# Altium project DEV_BOARD_FULL.PrjPcb (part 1 of 2)
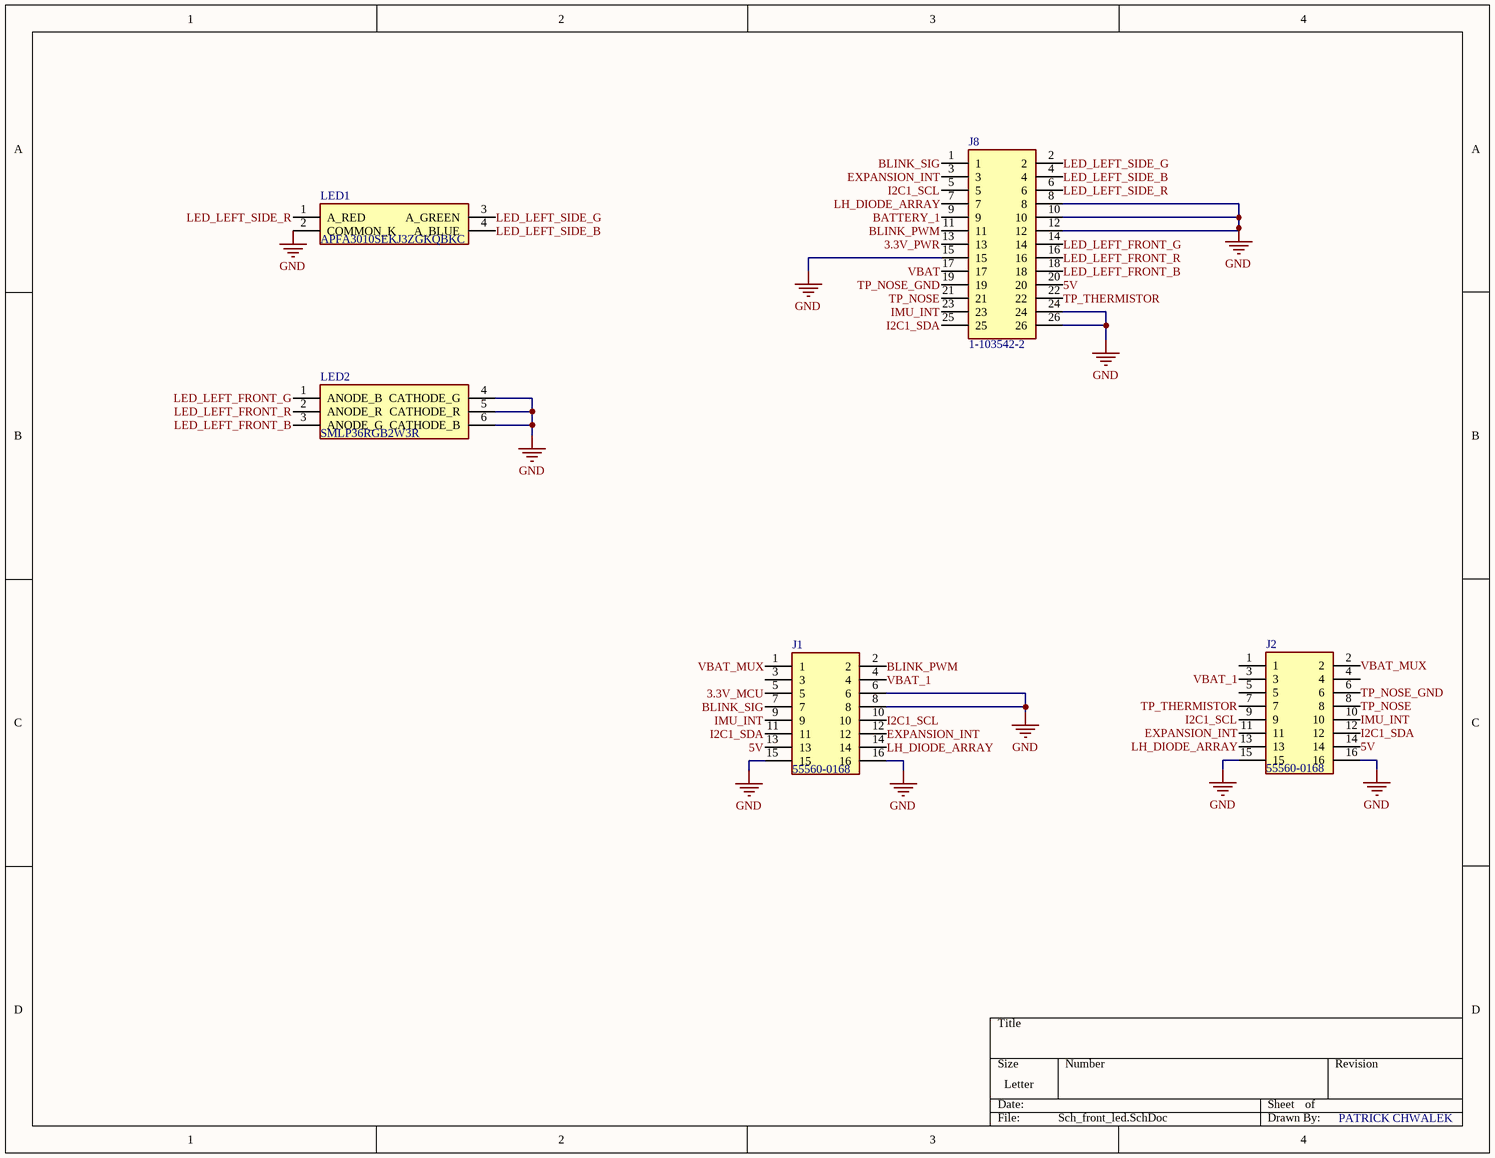
[diagram p0: Sch_front_led.SchDoc]
10 sheets, 179 parts. Net scope: global (net labels, ports and power ports of the same name join across sheets).
Board file: dev_board_layout.PcbDoc
Sheets:
  Sch_front_led.SchDoc
  Sch_front.SchDoc
  sch_pwr_brd_sensors.SchDoc
  Sch_pwr_brd_pwr_sys.SchDoc
  Sch_pwr_brd_pwr.SchDoc
  Sch_pwr_brd_MCU.SchDoc
  Sch_mcu_brd_sensors.SchDoc
  Sch_mcu_brd_pwr.SchDoc
  Sch_mcu_brd_external_connectors.SchDoc
  Sch_mcu_brd_mcu.SchDoc

## Sheet Sch_front_led.SchDoc
size Letter

### Parts
J1  55560-0168  [555600168]
J2  55560-0168  [555600168]
J8  1-103542-2  [HDRV26W89P254X254_2X13_3261X506X1074P]
LED1  APFA3010SEKJ3ZGKQBKC  [KPFA-3010RGBC-11]
LED2  SMLP36RGB2W3R  [ROHM-1510-(0604)]

### Nets
3.3V_MCU: J1.5
3.3V_PWR: J8.13
GND: J1.6 J1.8 J1.15 J1.16 J2.15 J2.16 J8.8 J8.10 J8.12 J8.15 J8.24 J8.26 LED1.2(COMMON_K) LED2.4(CATHODE_G) LED2.5(CATHODE_R) LED2.6(CATHODE_B)
5V: J1.13 J2.14 J8.20
BATTERY_1: J8.9
BLINK_PWM: J1.2 J8.11
BLINK_SIG: J1.7 J8.1
EXPANSION_INT: J1.12 J2.11 J8.3
I2C1_SCL: J1.10 J2.9 J8.5
I2C1_SDA: J1.11 J2.12 J8.25
IMU_INT: J1.9 J2.10 J8.23
LED_LEFT_FRONT_B: J8.18 LED2.3(ANODE_G)
LED_LEFT_FRONT_G: J8.14 LED2.1(ANODE_B)
LED_LEFT_FRONT_R: J8.16 LED2.2(ANODE_R)
LED_LEFT_SIDE_B: J8.4 LED1.4(A_BLUE)
LED_LEFT_SIDE_G: J8.2 LED1.3(A_GREEN)
LED_LEFT_SIDE_R: J8.6 LED1.1(A_RED)
LH_DIODE_ARRAY: J1.14 J2.13 J8.7
TP_NOSE: J2.8 J8.21
TP_NOSE_GND: J2.6 J8.19  [project net CMOUT]
TP_THERMISTOR: J2.7 J8.22
VBAT: J8.17
VBAT_1: J1.4 J2.3
VBAT_MUX: J1.1 J2.2

Not connected (* = marked no-connect by the designer): J1 3; J2 1 4 5

### Notes on the sheet
- PATRICK CHWALEK

### Library data of the parts
J1 J2 = 55560-0168: Connector; Manufacturer_Name: Molex; Allied_Number: 70374726; Datasheet Link: https://www.molex.com/pdm_docs/sd/555600168_sd.pdf; Height: 1.15mm; Manufacturer_Part_Number: 55560-0168; Mouser Part Number: 538-55560-0168; Mouser Price/Stock: https://www.mouser.com/Search/Refine.aspx?Keyword=538-55560-0168; RS Part Number: 7206558P; RS Price/Stock: http://uk.rs-online.com/web/p/products/7206558P; Allied Price/Stock: https://www.alliedelec.com/molexincorporated-55560-0168/70374726/
J8 = 1-103542-2: Connector; Manufacturer_Name: TE Connectivity; Datasheet Link: http://www.te.com/commerce/DocumentDelivery/DDEController?Action=showdoc&DocId=Customer+Drawing%7F103542%7FJ3%7Fpdf%7FEnglish%7FENG_CD_103542_J3.pdf%7F1-103542-2; Height: 10.744mm; Manufacturer_Part_Number: 1-103542-2; Mouser Part Number: 571-1-103542-2; Mouser Price/Stock: https://www.mouser.com/Search/Refine.aspx?Keyword=571-1-103542-2
LED1 = APFA3010SEKJ3ZGKQBKC: LED; Manufacturer_Name: Kingbright; Allied_Number: 70820377; Datasheet Link: http://www.kingbrightusa.com/images/catalog/SPEC/APFA3010SEKJ3ZGKQBKC.pdf; Manufacturer_Part_Number: APFA3010SEKJ3ZGKQBKC; Mouser Part Number: 604-APFA3010SEKJ3ZGK; Mouser Price/Stock: https://www.mouser.com/Search/Refine.aspx?Keyword=604-APFA3010SEKJ3ZGK; Allied Price/Stock: https://www.alliedelec.com/kingbright-apfa3010sekj3zgkqbkc/70820377/
LED2 = SMLP36RGB2W3R: LED; Manufacturer_Name: ROHM Semiconductor; Datasheet Link: http://www.rohm.com/web/global/datasheet/SMLP36RGB2W(R); Manufacturer_Part_Number: SMLP36RGB2W3R; Mouser Part Number: 755-SMLP36RGB2W3R; Mouser Price/Stock: https://www.mouser.com/Search/Refine.aspx?Keyword=755-SMLP36RGB2W3R; RS Part Number: 1246884; RS Price/Stock: https://uk.rs-online.com/web/p/products/1246884

## Sheet Sch_front.SchDoc
size A
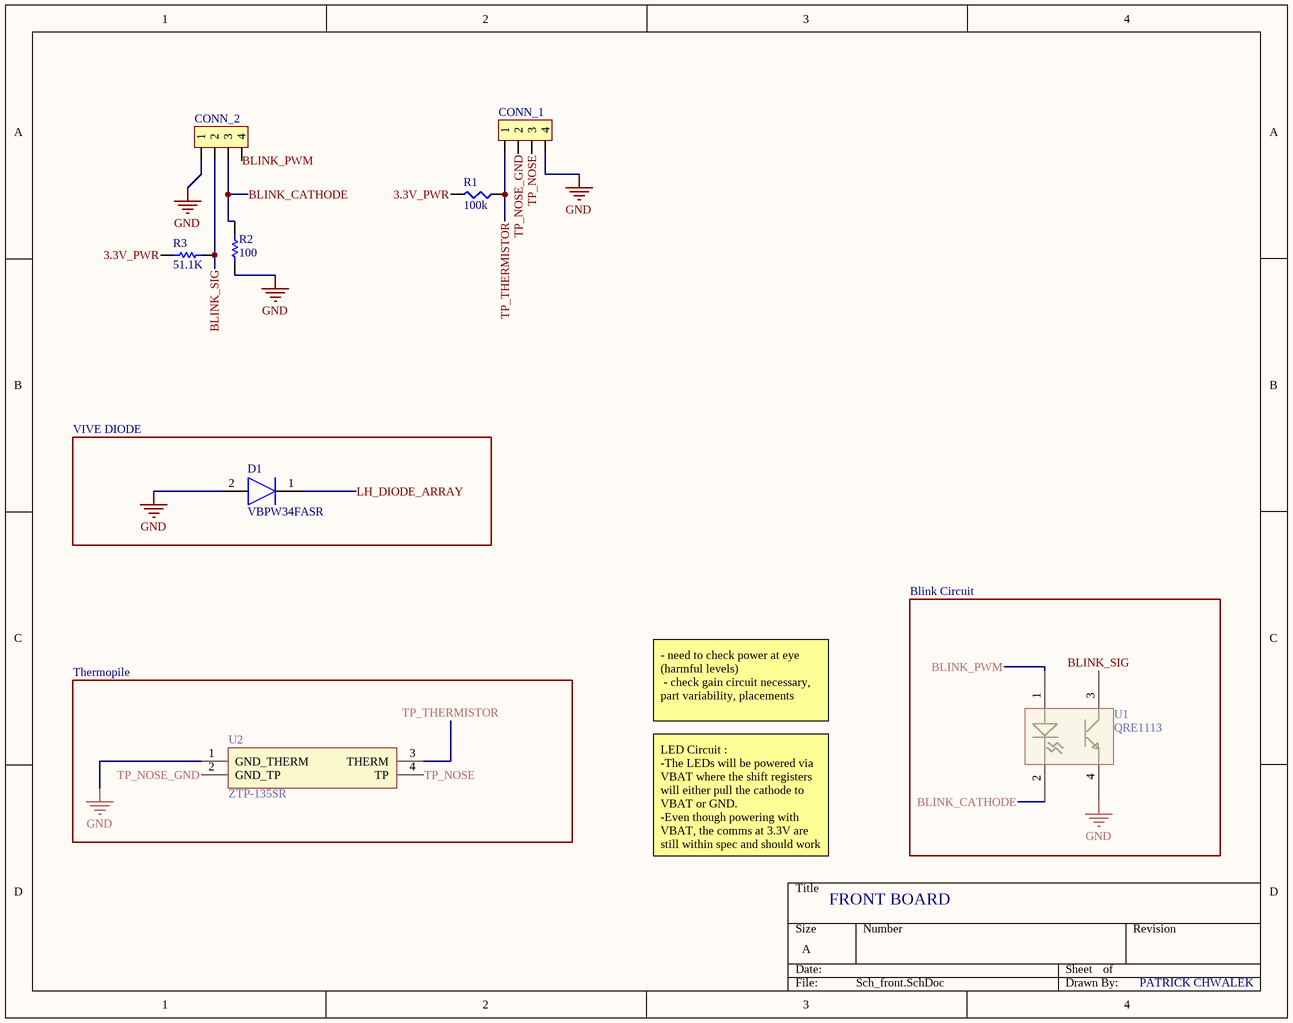
[diagram p1: Sch_front.SchDoc]

### Parts
CONN_1  THERMO  [4_pos_1mm_header]  (value not drawn)
CONN_2  BLINK  [4_pos_1mm_header]  (value not drawn)
D1  VBPW34FASR  [VBPW34FAS]
R1  100k  [SMD-0402-RES]
R2  100  [SMD-0402C]
R3  51.1K  [SMD-0402-RES]
U1  QRE1113  [QRE1113_DIP]
U2  ZTP-135SR  [ZTP-135SR]

### Blocks framed on the sheet
VIVE DIODE: D1
Blink Circuit: U1
Thermopile: U2

### Nets
3.3V_PWR: R1.2 R3.2
GND: CONN_1.4 CONN_2.1 D1.2(K) R2.1 U1.4 U2.1(GND_THERM)
BLINK_CATHODE: CONN_2.3 R2.2 U1.2
BLINK_PWM: CONN_2.4 U1.1
BLINK_SIG: CONN_2.2 R3.1 U1.3
LH_DIODE_ARRAY: D1.1(A)
TP_NOSE: CONN_1.3 U2.4(TP)
TP_NOSE_GND: CONN_1.2 U2.2(GND_TP)  [project net CMOUT]
TP_THERMISTOR: CONN_1.1 R1.1 U2.3(THERM)

### Notes on the sheet
- - need to check power at eye  (harmful levels)
  - check gain circuit necessary, part variability, placements
- LED Circuit :
  -The LEDs will be powered via VBAT where the shift registers will either pull the cathode to VBAT or GND.
  -Even though powering with VBAT, the comms at 3.3V are still within spec and should work
- FRONT BOARD
- PATRICK CHWALEK

### Library data of the parts
CONN_1 CONN_2 = 4_pin_1mm_header
D1 = VBPW34FASR: Diode; Manufacturer_Name: Vishay; Datasheet Link: https://www.vishay.com/docs/81127/vbpw34fa.pdf; Height: 1.3mm; Manufacturer_Part_Number: VBPW34FASR; Mouser Part Number: 782-VBPW34FASR; Mouser Price/Stock: https://www.mouser.com/Search/Refine.aspx?Keyword=782-VBPW34FASR; RS Part Number: 7689401; RS Price/Stock: https://uk.rs-online.com/web/p/products/7689401
R1 = ERJ-2GEJ104X: RES SMD 100K OHM 5% 1/10W 0402; Manufacturer: Panasonic Electronic Components; Factory Stock: 0; Unit Price (USD): 0.00350; @ qty: 1500; Minimum Quantity: 1; Power (Watts): 0.1W, 1/10W; Temperature Coefficient: ±200ppm/°C; Part Number: ERJ-2GEJ104X; Datasheets: http://industrial.panasonic.com/www-cgi/jvcr13pz.cgi?E+PZ+3+AOA0001+ERJ2GEJ104X+7+WW; Image: //media.digikey.com/Photos/Panasonic%20Photos/ERJ-PA2-Series.jpg; Digi-Key Part Number: P100KJCT-ND; Quantity Available: 2387986; Packaging: Cut Tape (CT); Series: ERJ; Part Status: Active; Value: 100k; Tolerance: ±5%; Composition: Thick Film; Features: Automotive AEC-Q200; Operating Temperature: -55°C ~ 155°C; Package / Case: 0402 (1005 Metric); Supplier Device Package: 0402; Size / Dimension: 0.039" L x 0.020" W (1.00mm x 0.50mm); Height - Seated (Max): 0.016" (0.40mm); Number of Terminations: 2; Failure Rate: -
R2 R3 = Resistor
U1 = QRE1113: IR Emitter and Receiver
U2 = ZTP-135SR: Undefined or Miscellaneous; Manufacturer_Name: Amphenol Advanced Sensors; Allied_Number: 70282698; Datasheet Link: https://www.amphenol-sensors.com/en/component/edocman/370-thermopile-ir-sensor-applications/download?Itemid=7967; Manufacturer_Part_Number: ZTP-135SR; Mouser Part Number: 527-ZTP-135SR; Mouser Price/Stock: https://www.mouser.com/Search/Refine.aspx?Keyword=527-ZTP-135SR; Allied Price/Stock: https://www.alliedelec.com/amphenol-advanced-sensors-ztp-135sr/70282698/

## Sheet sch_pwr_brd_sensors.SchDoc
size Letter
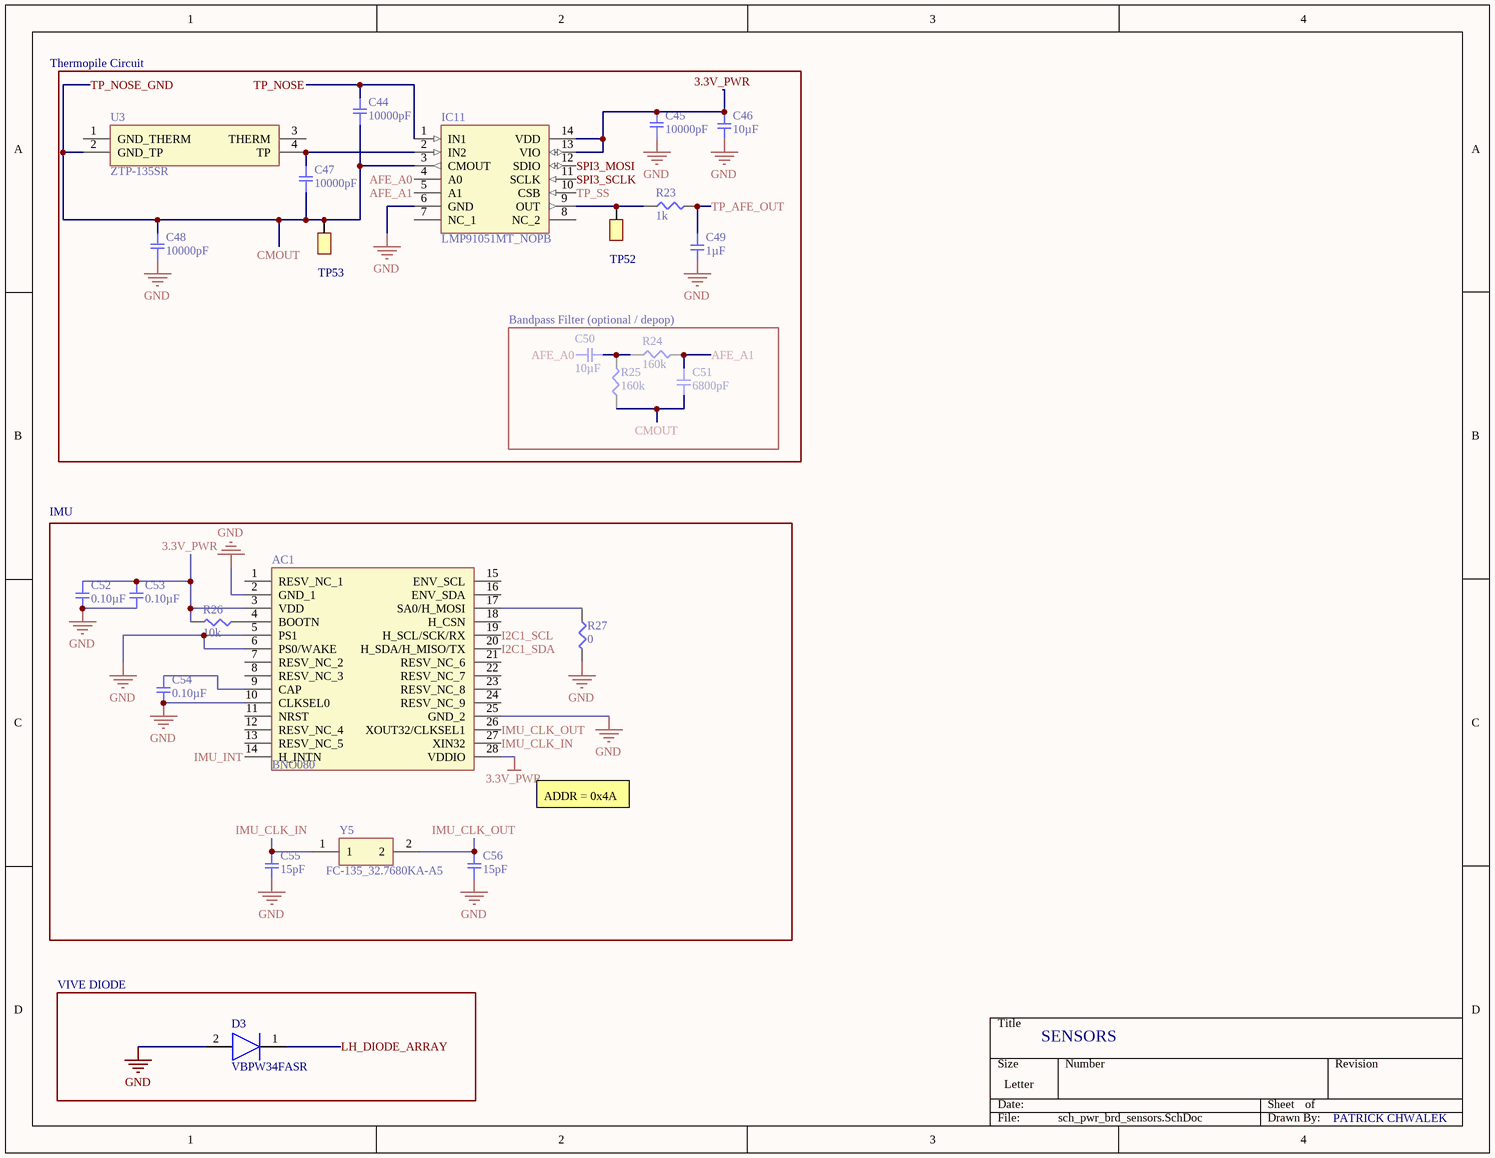
[diagram p2: sch_pwr_brd_sensors.SchDoc]

### Parts
AC1  BNO080  [BNO080]
C44  10000pF  [SMD-0402C]
C45  10000pF  [SMD-0402C]
C46  10µF  [SMD-0402C]
C47  10000pF  [SMD-0402C]
C48  10000pF  [SMD-0402C]
C49  1µF  [SMD-0402C]
C50  10µF  [SMD-0402C]
C51  6800pF  [SMD-0402C]
C52  0.10µF  [CAPC1005X55N]
C53  0.10µF  [CAPC1005X55N]
C54  0.10µF  [CAPC1005X55N]
C55  15pF  [CAPC1005X55N]
C56  15pF  [CAPC1005X55N]
D3  VBPW34FASR  [VBPW34FASR]
IC11  LMP91051MT_NOPB  [SOP65P640X120-14N]
R23  1k  [SMD-0402-RES]
R24  160k  [SMD-0402-RES]
R25  160k  [SMD-0402-RES]
R26  10k  [SMD-0402-RES]
R27  0  [SMD-0402-RES]
TP52  TestPoint  [TestPoint_0.4mm]  (value not drawn)
TP53  TestPoint  [TestPoint_0.4mm]  (value not drawn)
U3  ZTP-135SR  [ZTP-135SR]
Y5  FC-135_32.7680KA-A5  [FC135327680KAAG0]

### Blocks framed on the sheet
Bandpass Filter (optional / depop): C50 C51 R24 R25
IMU: AC1 C52-C56 R26 R27 Y5
VIVE DIODE: D3

### Nets
3.3V_PWR: AC1.3(VDD) AC1.28(VDDIO) C45.2 C46.1 C52.1 C53.1 IC11.13(VIO) IC11.14(VDD) R26.2
GND: AC1.2(GND_1) AC1.5(PS1) AC1.6(PS0/WAKE) AC1.10(CLKSEL0) AC1.25(GND_2) C45.1 C46.2 C48.1 C49.2 C52.2 C53.2 C54.2 C55.2 C56.2 D3.2(K) IC11.6(GND) R27.2
AFE_A0: C50.1 IC11.4(A0)
AFE_A1: C51.1 IC11.5(A1) R24.2
CMOUT: C44.1 C47.1 C48.2 C51.2 IC11.3(CMOUT) R25.1 TP53.1 U3.2(GND_TP)  [also labelled TP_NOSE_GND]
I2C1_SCL: AC1.19(H_SCL/SCK/RX)
I2C1_SDA: AC1.20(H_SDA/H_MISO/TX)
IMU_CLK_IN: AC1.27(XIN32) C55.1 Y5.1
IMU_CLK_OUT: AC1.26(XOUT32/CLKSEL1) C56.1 Y5.2
IMU_INT: AC1.14(H_INTN)
LH_DIODE_ARRAY: D3.1(A)
SPI3_MOSI: IC11.12(SDIO)
SPI3_SCLK: IC11.11(SCLK)
TP_AFE_OUT: C49.1 R23.2
TP_NOSE: C44.2 IC11.1(IN1)
TP_SS: IC11.10(CSB)
NetAC1_4: AC1.4(BOOTN) R26.1
NetAC1_9: AC1.9(CAP) C54.1
NetAC1_17: AC1.17(SA0/H_MOSI) R27.1
NetC47_2: C47.2 IC11.2(IN2) U3.4(TP)
NetC50_2: C50.2 R24.1 R25.2
NetIC11_9: IC11.9(OUT) R23.1 TP52.1

Not connected (* = marked no-connect by the designer): AC1 1(RESV_NC_1) 7(RESV_NC_2) 8(RESV_NC_3) 11(NRST) 12(RESV_NC_4) 13(RESV_NC_5) 15(ENV_SCL) 16(ENV_SDA) 18(H_CSN) 21(RESV_NC_6) 22(RESV_NC_7) 23(RESV_NC_8) 24(RESV_NC_9); IC11 7(NC_1) 8(NC_2); U3 1(GND_THERM) 3(THERM)

### Notes on the sheet
- Thermopile Circuit
- ADDR = 0x4A
- SENSORS
- PATRICK CHWALEK

### Library data of the parts
AC1 = BNO080: Accelerometer; Manufacturer_Name: Hillcrest Laboratories; Datasheet Link: http://www.hillcrestlabs.com/download/5a05f340566d07c196001ec1; Height: 1.18mm; Manufacturer_Part_Number: BNO080
C44 C45 C47 C48 = GCM155R71H103KA55D: CAP CER 10000PF 50V X7R 0402; Manufacturer: Murata Electronics North America; Factory Stock: 0; Unit Price (USD): 0.1; Minimum Quantity: 1; Tolerance: ±10%; Datasheets: http://www.murata.com/~/media/webrenewal/support/library/catalog/products/capacitor/mlcc/c03e.ashx; Image: //media.digikey.com/Renders/Murata%20Renders/ZRB-SERIES-0402.jpg; Digi-Key Part Number: 490-4762-1-ND; Part Number: GCM155R71H103KA55D; Quantity Available: 650067; @ qty: 0; Packaging: Cut Tape (CT); Series: GCM; Part Status: Active; Value: 10000pF; Voltage: 50V; Temperature Coefficient: X7R; Operating Temperature: -55°C ~ 125°C; Features: -; Ratings: AEC-Q200; Applications: Automotive; Mounting Type: Surface Mount, MLCC; Package / Case: 0402 (1005 Metric); Size / Dimension: 0.039" L x 0.020" W (1.00mm x 0.50mm); Height - Seated (Max): -; Thickness (Max): 0.022" (0.55mm); Lead Spacing: -; Lead Style: -
C46 C50 = GRJ155R60J106ME11D: CAP CER 10UF 6.3V X5R 0402; Manufacturer: Murata Electronics North America; Factory Stock: 0; Unit Price (USD): 0.23; Minimum Quantity: 1; Tolerance: ±20%; Datasheets: http://psearch.en.murata.com/capacitor/product/GRJ155R60J106ME11%23.pdf; Image: //media.digikey.com/Renders/Murata%20Renders/ZRB-SERIES-0402.jpg; Digi-Key Part Number: 490-13211-1-ND; Part Number: GRJ155R60J106ME11D; Quantity Available: 64064; @ qty: 0; Packaging: Cut Tape (CT); Series: GRJ; Part Status: Active; Value: 10µF; Voltage: 6.3V; Temperature Coefficient: X5R; Operating Temperature: -55°C ~ 85°C; Features: Derating Recommended, Soft Termination; Ratings: -; Applications: Boardflex Sensitive; Mounting Type: Surface Mount, MLCC; Package / Case: 0402 (1005 Metric); Size / Dimension: 0.039" L x 0.020" W (1.00mm x 0.50mm); Height - Seated (Max): -; Thickness (Max): 0.028" (0.70mm); Lead Spacing: -; Lead Style: -
C49 = GCM155C71A105KE38D: CAP CER 1UF 10V X7S 0402; Manufacturer: Murata Electronics North America; Factory Stock: 0; Unit Price (USD): 0.12; Minimum Quantity: 1; Tolerance: ±10%; Datasheets: http://www.murata.com/~/media/webrenewal/support/library/catalog/products/capacitor/mlcc/c03e.ashx; Image: //media.digikey.com/Renders/Murata%20Renders/ZRB-SERIES-0402.jpg; Digi-Key Part Number: 490-13409-1-ND; Part Number: GCM155C71A105KE38D; Quantity Available: 7240; @ qty: 0; Packaging: Cut Tape (CT); Series: GCM; Part Status: Active; Value: 1µF; Voltage: 10V; Temperature Coefficient: X7S; Operating Temperature: -55°C ~ 125°C; Features: -; Ratings: AEC-Q200; Applications: Automotive; Mounting Type: Surface Mount, MLCC; Package / Case: 0402 (1005 Metric); Size / Dimension: 0.039" L x 0.020" W (1.00mm x 0.50mm); Height - Seated (Max): -; Thickness (Max): 0.022" (0.55mm); Lead Spacing: -; Lead Style: -
C51 = GRM155R71E682KA01J: CAP CER 6800PF 25V X7R 0402; Manufacturer: Murata Electronics North America; Factory Stock: 0; Unit Price (USD): 0.1; Minimum Quantity: 1; Tolerance: ±10%; Datasheets: http://www.murata.com/~/media/webrenewal/support/library/catalog/products/capacitor/mlcc/c02e.pdf; Image: //media.digikey.com/Renders/Murata%20Renders/ZRB-SERIES-0402.jpg; Digi-Key Part Number: 490-11422-1-ND; Part Number: GRM155R71E682KA01J; Quantity Available: 44380; @ qty: 0; Packaging: Cut Tape (CT); Series: GRM; Part Status: Active; Value: 6800pF; Voltage: 25V; Temperature Coefficient: X7R; Operating Temperature: -55°C ~ 125°C; Features: -; Ratings: -; Applications: General Purpose; Mounting Type: Surface Mount, MLCC; Package / Case: 0402 (1005 Metric); Size / Dimension: 0.039" L x 0.020" W (1.00mm x 0.50mm); Height - Seated (Max): -; Thickness (Max): 0.022" (0.55mm); Lead Spacing: -; Lead Style: -
C52-C54 = GCM155R71C104KA55D: CAP CER 0.1UF 16V X7R 0402; Manufacturer: Murata Electronics North America; Factory Stock: 0; Unit Price (USD): 0.1; Minimum Quantity: 1; Tolerance: ±10%; Datasheets: http://www.murata.com/~/media/webrenewal/support/library/catalog/products/capacitor/mlcc/c03e.ashx; Image: //media.digikey.com/Renders/Murata%20Renders/ZRB-SERIES-0402.jpg; Digi-Key Part Number: 490-4759-1-ND; Part Number: GCM155R71C104KA55D; Quantity Available: 734194; @ qty: 0; Packaging: Cut Tape (CT); Series: GCM; Part Status: Active; Value: 0.10µF; Voltage: 16V; Temperature Coefficient: X7R; Operating Temperature: -55°C ~ 125°C; Features: -; Ratings: AEC-Q200; Applications: Automotive; Mounting Type: Surface Mount, MLCC; Package / Case: 0402 (1005 Metric); Size / Dimension: 0.039" L x 0.020" W (1.00mm x 0.50mm); Height - Seated (Max): -; Thickness (Max): 0.022" (0.55mm); Lead Spacing: -; Lead Style: -
C55 C56 = GCM1555C1H150JA16D: CAP CER 15PF 50V NP0 0402; Manufacturer: Murata Electronics North America; Factory Stock: 0; Unit Price (USD): 0.1; Minimum Quantity: 1; Tolerance: ±5%; Temperature Coefficient: C0G, NP0; Datasheets: http://www.murata.com/~/media/webrenewal/support/library/catalog/products/capacitor/mlcc/c03e.ashx; Image: //media.digikey.com/Renders/Murata%20Renders/ZRB-SERIES-0402.jpg; Digi-Key Part Number: 490-11147-1-ND; Part Number: GCM1555C1H150JA16D; Quantity Available: 6185; @ qty: 0; Packaging: Cut Tape (CT); Series: GCM; Part Status: Active; Value: 15pF; Voltage: 50V; Operating Temperature: -55°C ~ 125°C; Features: -; Ratings: AEC-Q200; Applications: Automotive; Mounting Type: Surface Mount, MLCC; Package / Case: 0402 (1005 Metric); Size / Dimension: 0.039" L x 0.020" W (1.00mm x 0.50mm); Height - Seated (Max): -; Thickness (Max): 0.022" (0.55mm); Lead Spacing: -; Lead Style: -
D3 = VBPW34FASR: Diode; Manufacturer_Name: Vishay; Datasheet Link: https://www.vishay.com/docs/81127/vbpw34fa.pdf; Height: 1.3mm; Manufacturer_Part_Number: VBPW34FASR; Mouser Part Number: 782-VBPW34FASR; Mouser Price/Stock: https://www.mouser.com/Search/Refine.aspx?Keyword=782-VBPW34FASR; RS Part Number: 7689401; RS Price/Stock: https://uk.rs-online.com/web/p/products/7689401
IC11 = LMP91051MT_NOPB: Integrated Circuit; Manufacturer_Name: Texas Instruments; Manufacturer_Part_Number: LMP91051MT/NOPB; Datasheet Link: http://www.ti.com/lit/ds/symlink/lmp91051.pdf; Height: 1.2mm; Mouser Part Number: 595-LMP91051MT/NOPB; Mouser Price/Stock: https://www.mouser.com/Search/Refine.aspx?Keyword=595-LMP91051MT%2FNOPB
R23 = ERJ-2GEJ102X: RES SMD 1K OHM 5% 1/10W 0402; Manufacturer: Panasonic Electronic Components; Factory Stock: 0; Unit Price (USD): 0.00350; @ qty: 1500; Minimum Quantity: 1; Power (Watts): 0.1W, 1/10W; Temperature Coefficient: ±200ppm/°C; Part Number: ERJ-2GEJ102X; Datasheets: http://industrial.panasonic.com/www-cgi/jvcr13pz.cgi?E+PZ+3+AOA0001+ERJ2GEJ102X+7+WW; Image: //media.digikey.com/Photos/Panasonic%20Photos/ERJ-PA2-Series.jpg; Digi-Key Part Number: P1.0KJCT-ND; Quantity Available: 1939857; Packaging: Cut Tape (CT); Series: ERJ; Part Status: Active; Value: 1k; Tolerance: ±5%; Composition: Thick Film; Features: Automotive AEC-Q200; Operating Temperature: -55°C ~ 155°C; Package / Case: 0402 (1005 Metric); Supplier Device Package: 0402; Size / Dimension: 0.039" L x 0.020" W (1.00mm x 0.50mm); Height - Seated (Max): 0.016" (0.40mm); Number of Terminations: 2; Failure Rate: -
R24 R25 = ERJ-2GEJ164X: RES SMD 160K OHM 5% 1/10W 0402; Manufacturer: Panasonic Electronic Components; Factory Stock: 0; Unit Price (USD): 0.00350; @ qty: 1500; Minimum Quantity: 1; Power (Watts): 0.1W, 1/10W; Temperature Coefficient: ±200ppm/°C; Part Number: ERJ-2GEJ164X; Datasheets: http://industrial.panasonic.com/www-cgi/jvcr13pz.cgi?E+PZ+3+AOA0001+ERJ2GEJ164X+7+WW; Image: //media.digikey.com/Photos/Panasonic%20Photos/ERJ-PA2-Series.jpg; Digi-Key Part Number: P160KJCT-ND; Quantity Available: 64191; Packaging: Cut Tape (CT); Series: ERJ; Part Status: Active; Value: 160k; Tolerance: ±5%; Composition: Thick Film; Features: Automotive AEC-Q200; Operating Temperature: -55°C ~ 155°C; Package / Case: 0402 (1005 Metric); Supplier Device Package: 0402; Size / Dimension: 0.039" L x 0.020" W (1.00mm x 0.50mm); Height - Seated (Max): 0.016" (0.40mm); Number of Terminations: 2; Failure Rate: -
R26 = ERJ-2GEJ103X: RES SMD 10K OHM 5% 1/10W 0402; Manufacturer: Panasonic Electronic Components; Factory Stock: 0; Unit Price (USD): 0.00350; @ qty: 1500; Minimum Quantity: 1; Power (Watts): 0.1W, 1/10W; Temperature Coefficient: ±200ppm/°C; Part Number: ERJ-2GEJ103X; Datasheets: http://industrial.panasonic.com/www-cgi/jvcr13pz.cgi?E+PZ+3+AOA0001+ERJ2GEJ103X+7+WW; Image: //media.digikey.com/Photos/Panasonic%20Photos/ERJ-PA2-Series.jpg; Digi-Key Part Number: P10KJCT-ND; Quantity Available: 2560215; Packaging: Cut Tape (CT); Series: ERJ; Part Status: Active; Value: 10k; Tolerance: ±5%; Composition: Thick Film; Features: Automotive AEC-Q200; Operating Temperature: -55°C ~ 155°C; Package / Case: 0402 (1005 Metric); Supplier Device Package: 0402; Size / Dimension: 0.039" L x 0.020" W (1.00mm x 0.50mm); Height - Seated (Max): 0.016" (0.40mm); Number of Terminations: 2; Failure Rate: -
R27 = ERJ-2GEJ103X: RES SMD 0K OHM 5% 1/10W 0402; Manufacturer: Panasonic Electronic Components; Unit Price (USD): 0.00350; @ qty: 1500; Minimum Quantity: 1; Power (Watts): 0.1W, 1/10W; Temperature Coefficient: ±200ppm/°C; Part Number: ERJ-2GEJ103X; Datasheets: http://industrial.panasonic.com/www-cgi/jvcr13pz.cgi?E+PZ+3+AOA0001+ERJ2GEJ103X+7+WW; Image: //media.digikey.com/Photos/Panasonic%20Photos/ERJ-PA2-Series.jpg; Digi-Key Part Number: P10KJCT-ND; Quantity Available: 2560215; Factory Stock: 0; Packaging: Cut Tape (CT); Series: ERJ; Part Status: Active; Value: 0; Tolerance: ±5%; Composition: Thick Film; Features: Automotive AEC-Q200; Operating Temperature: -55°C ~ 155°C; Package / Case: 0402 (1005 Metric); Supplier Device Package: 0402; Size / Dimension: 0.039" L x 0.020" W (1.00mm x 0.50mm); Height - Seated (Max): 0.016" (0.40mm); Number of Terminations: 2; Failure Rate: -
U3 = ZTP-135SR: as U2 on sheet Sch_front; Datasheet Link: https://www.amphenol-sensors.com/en/component/edocman/370-thermopile-ir-sensor-applications/download?Itemid=7967; Manufacturer_Part_Number: ZTP-135SR; Mouser Part Number: 527-ZTP-135SR; Mouser Price/Stock: https://www.mouser.com/Search/Refine.aspx?Keyword=527-ZTP-135SR; Allied Price/Stock: https://www.alliedelec.com/amphenol-advanced-sensors-ztp-135sr/70282698/
Y5 = FC-135_32.7680KA-A3: Crystal or Oscillator; Manufacturer_Name: Epson Timing; Manufacturer_Part_Number: FC-135 32.7680KA-A5; Datasheet Link: https://support.epson.biz/td/api/doc_check.php?dl=brief_fc-135r_en.pdf; Height: 0mm; Mouser Part Number: 732-FC135-32.76KAA3; Mouser Price/Stock: https://www.mouser.com/Search/Refine.aspx?Keyword=732-FC135-32.76KAA3

## Sheet Sch_pwr_brd_pwr_sys.SchDoc
size Letter
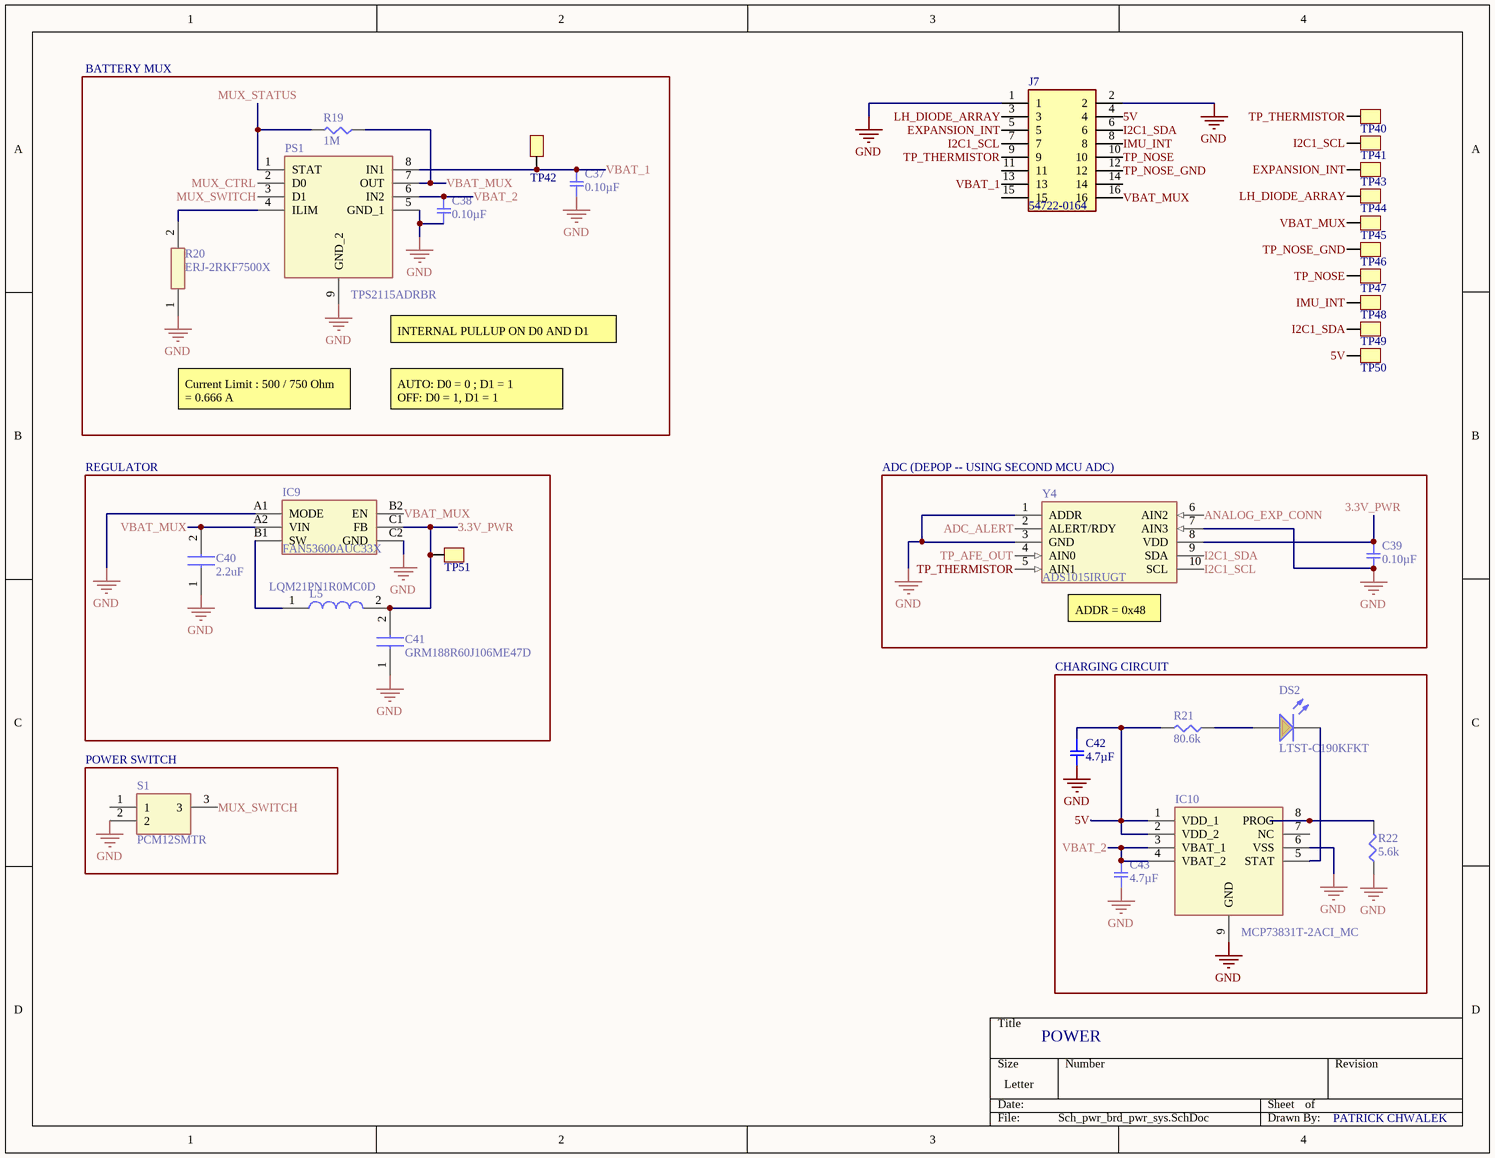
[diagram p3: Sch_pwr_brd_pwr_sys.SchDoc]

### Parts
C37  0.10µF  [SMD-0402C]
C38  0.10µF  [SMD-0402C]
C39  0.10µF  [SMD-0402C]
C40  2.2uF  [CAPC1005X55N]
C41  GRM188R60J106ME47D  [CAPC1608X09N]
C42  4.7µF  [SMD-0402C]
C43  4.7µF  [SMD-0402C]
DS2  LTST-C190KFKT  [LTST-C190KFKT_V]
IC9  FAN53600AUC33X  [BGA6C40P2X3_86X116X62]
IC10  MCP73831T-2ACI_MC  [SON50P300X200X100-9N-D]
J7  54722-0164  [54722-0164]
L5  LQM21PN1R0MC0D  [INDC2012X55N]
PS1  TPS2115ADRBR  [SON65P300X300X100-9N-D]
R19  1M  [SMD-0402-RES]
R20  ERJ-2RKF7500X  [RESC1005X40N]
R21  80.6k  [SMD-0402-RES]
R22  5.6k  [SMD-0402-RES]
S1  PCM12SMTR  [PCM12SMTR_1]
TP40  TestPoint  [TestPoint_0.4mm]  (value not drawn)
TP41  TestPoint  [TestPoint_0.4mm]  (value not drawn)
TP42  TestPoint  [TestPoint_0.4mm]  (value not drawn)
TP43  TestPoint  [TestPoint_0.4mm]  (value not drawn)
TP44  TestPoint  [TestPoint_0.4mm]  (value not drawn)
TP45  TestPoint  [TestPoint_0.4mm]  (value not drawn)
TP46  TestPoint  [TestPoint_0.4mm]  (value not drawn)
TP47  TestPoint  [TestPoint_0.4mm]  (value not drawn)
TP48  TestPoint  [TestPoint_0.4mm]  (value not drawn)
TP49  TestPoint  [TestPoint_0.4mm]  (value not drawn)
TP50  TestPoint  [TestPoint_0.4mm]  (value not drawn)
TP51  TestPoint  [TestPoint_0.4mm]  (value not drawn)
Y4  ADS1015IRUGT  [ADS7142IRUGT]

### Blocks framed on the sheet
BATTERY MUX: C37 C38 PS1 R19 R20 TP42
REGULATOR: C40 C41 IC9 L5 TP51
ADC (DEPOP -- USING SECOND MCU ADC): C39 Y4
CHARGING CIRCUIT: C42 C43 DS2 IC10 R21 R22
POWER SWITCH: S1

### Nets
3.3V_PWR: C39.1 C41.2 IC9.C1(FB) L5.2 TP51.1 Y4.8(VDD)
GND: C37.2 C38.2 C39.2 C40.1 C41.1 C42.2 C43.2 IC9.A1(MODE) IC9.C2(GND) IC10.6(VSS) IC10.9(GND) J7.1 J7.2 PS1.5(GND_1) PS1.9(GND_2) R20.1 R22.1 S1.2 Y4.1(ADDR) Y4.3(GND) Y4.7(AIN3)
5V: C42.1 IC10.1(VDD_1) IC10.2(VDD_2) J7.4 R21.2 TP50.1
ADC_ALERT: Y4.2(ALERT/RDY)
ANALOG_EXP_CONN: Y4.6(AIN2)
EXPANSION_INT: J7.5 TP43.1
I2C1_SCL: J7.7 TP41.1 Y4.10(SCL)
I2C1_SDA: J7.6 TP49.1 Y4.9(SDA)
IMU_INT: J7.8 TP48.1
LH_DIODE_ARRAY: J7.3 TP44.1
MUX_CTRL: PS1.2(D0)
MUX_STATUS: PS1.1(STAT) R19.2
MUX_SWITCH: PS1.3(D1) S1.3
TP_AFE_OUT: Y4.4(AIN0)
TP_NOSE: J7.10 TP47.1
TP_NOSE_GND: J7.12 TP46.1  [project net CMOUT]
TP_THERMISTOR: J7.9 TP40.1 Y4.5(AIN1)
VBAT_1: C37.1 J7.13 PS1.8(IN1) TP42.1
VBAT_2: C38.1 C43.1 IC10.3(VBAT_1) IC10.4(VBAT_2) PS1.6(IN2)
VBAT_MUX: C40.2 IC9.A2(VIN) IC9.B2(EN) J7.16 PS1.7(OUT) R19.1 TP45.1
NetDS2_1: DS2.1(A) R21.1
NetDS2_2: DS2.2(K) IC10.5(STAT)
NetIC9_B1: IC9.B1(SW) L5.1
NetIC10_8: IC10.8(PROG) R22.2
NetPS1_4: PS1.4(ILIM) R20.2

Not connected (* = marked no-connect by the designer): IC10 7(NC); J7 11 14 15; S1 1

### Notes on the sheet
- (near PS1) INTERNAL PULLUP ON D0 AND D1
- Current Limit : 500 / 750 Ohm = 0.666 A
- AUTO: D0 = 0 ; D1 = 1
  OFF: D0 = 1, D1 = 1
- (near Y4) ADDR = 0x48
- POWER
- PATRICK CHWALEK

### Library data of the parts
C37-C39 = GCM155R71C104KA55D: as C52 on sheet sch_pwr_brd_sensors; Datasheets: http://www.murata.com/~/media/webrenewal/support/library/catalog/products/capacitor/mlcc/c03e.ashx; Image: //media.digikey.com/Renders/Murata%20Renders/ZRB-SERIES-0402.jpg; Digi-Key Part Number: 490-4759-1-ND; Part Number: GCM155R71C104KA55D; Quantity Available: 734194; @ qty: 0; Packaging: Cut Tape (CT); Series: GCM; Part Status: Active; Value: 0.10µF; Voltage: 16V; Temperature Coefficient: X7R; Operating Temperature: -55°C ~ 125°C; Features: -; Ratings: AEC-Q200; Applications: Automotive; Mounting Type: Surface Mount, MLCC; Package / Case: 0402 (1005 Metric); Size / Dimension: 0.039" L x 0.020" W (1.00mm x 0.50mm); Height - Seated (Max): -; Thickness (Max): 0.022" (0.55mm); Lead Spacing: -; Lead Style: -
C40 = GRM155R60J225ME15D: Capacitor; Manufacturer_Name: Murata Electronics; Datasheet Link: http://www.murata.com/~/media/webrenewal/support/library/catalog/products/capacitor/mlcc/c02e.pdf; Height: 0.55mm; Manufacturer_Part_Number: GRM155R60J225ME15D; Mouser Part Number: 81-GRM155R60J225ME5D; Mouser Price/Stock: https://www.mouser.com/Search/Refine.aspx?Keyword=81-GRM155R60J225ME5D; RS Part Number: 8145227; RS Price/Stock: https://uk.rs-online.com/web/p/products/8145227
C41 = GRM188R60J106ME47D: Capacitor; Manufacturer_Name: Murata Electronics; Datasheet Link: http://psearch.en.murata.com/capacitor/product/GRM188R60J106ME47%23.pdf; Height: 0.9mm; Manufacturer_Part_Number: GRM188R60J106ME47D; Mouser Part Number: 81-GRM188R60J106ME47; Mouser Price/Stock: https://www.mouser.com/Search/Refine.aspx?Keyword=81-GRM188R60J106ME47; RS Part Number: 7235543P; RS Price/Stock: http://uk.rs-online.com/web/p/products/7235543P
C42 C43 = GRM153R60G475ME15D: CAP CER 4.7UF 4V X5R 0402; Manufacturer: Murata Electronics North America; Factory Stock: 0; Unit Price (USD): 0.27; Minimum Quantity: 1; Tolerance: ±20%; Datasheets: http://psearch.en.murata.com/capacitor/product/GRM153R60G475ME15%23.pdf; Image: //media.digikey.com/Renders/Murata%20Renders/ZRB-SERIES-0402.jpg; Digi-Key Part Number: 490-13231-1-ND; Part Number: GRM153R60G475ME15D; Quantity Available: 9100; @ qty: 0; Packaging: Cut Tape (CT); Series: GRM; Part Status: Active; Value: 4.7µF; Voltage: 4V; Temperature Coefficient: X5R; Operating Temperature: -55°C ~ 85°C; Features: -; Ratings: -; Applications: General Purpose; Mounting Type: Surface Mount, MLCC; Package / Case: 0402 (1005 Metric); Size / Dimension: 0.039" L x 0.020" W (1.00mm x 0.50mm); Height - Seated (Max): -; Thickness (Max): 0.013" (0.33mm); Lead Spacing: -; Lead Style: -
DS2 = CMP-1674-00008-1: LED Uni-Color Orange, 75 mW, 30 mA, -35 to 85 degC, 2-Pin SMD, RoHS, Tape and Reel; Resistance: 47 kohm; Power Rating: 100 mW; Case\Package: 0603; Tolerance: 1%; Voltage Rating (DC): 50 V; ComponentLink2URL: http://optoelectronics.liteon.com/upload/download/DS-22-99-0186/S_110_LTST-C190KFKT.pdf; Mount: Surface Mount; Pins: 2; Package Quantity: 5000; Max Operating Temperature: 155 degC; RoHSCompliant: true; PackageDescription: 2-Pin Surface Mount Device, Body 1.6 x 0.8 mm; Case Code (Metric): 1608; PackageReference: C190KFKT; Height: 0.45 mm; ComponentLink2Description: Datasheet; Min Operating Temperature: -55 degC; DatasheetVersion: Rev. I, 09/2011; Packaging: Tape and Reel; ComponentLink1Description: Manufacturer URL; ComponentLink1URL: http://www.us.liteon.com/; Voltage Rating: 50 V; Case Code (Imperial): 0603; Length: 1.6 mm; Width: 0.8 mm; REACH SVHC: No SVHC
IC9 = FAN53600AUC33X: Integrated Circuit; Manufacturer_Name: Fairchild Semiconductor; Datasheet Link: https://www.onsemi.com/pub/Collateral/FAN53610-D.pdf; Height: 0.625mm; Manufacturer_Part_Number: FAN53600AUC33X; Mouser Part Number: 512-FAN53600AUC33X; Mouser Price/Stock: https://www.mouser.com/Search/Refine.aspx?Keyword=512-FAN53600AUC33X
IC10 = MCP73831T-2ACI_MC: Integrated Circuit; Manufacturer_Name: Microchip; Manufacturer_Part_Number: MCP73831T-2ACI/MC; Allied_Number: 70452042; Datasheet Link: http://ww1.microchip.com/downloads/en/DeviceDoc/20001984g.pdf; Height: 1mm; Mouser Part Number: 579-MCP73831T-2ACIMC; Mouser Price/Stock: https://www.mouser.com/Search/Refine.aspx?Keyword=579-MCP73831T-2ACIMC; Allied Price/Stock: https://www.alliedelec.com/microchiptechnologyinc-mcp73831t-2aci-mc/70452042/
J7 = 54722-0164: Connector; Manufacturer_Name: Molex; Datasheet Link: http://www.molex.com/webdocs/datasheets/pdf/en-us//0547220164_PCB_RECEPTACLES.pdf; Manufacturer_Part_Number: 54722-0164; Mouser Part Number: 538-54722-0164; Mouser Price/Stock: https://www.mouser.com/Search/Refine.aspx?Keyword=538-54722-0164; RS Part Number: 7206511; RS Price/Stock: https://uk.rs-online.com/web/p/products/7206511
L5 = LQM21PN1R0MC0D: Inductor; Manufacturer_Name: Murata Electronics; Datasheet Link: https://componentsearchengine.com/Datasheets/2/LQM21PN1R0MC0D.pdf; Height: 0.55mm; Manufacturer_Part_Number: LQM21PN1R0MC0D; Mouser Part Number: 81-LQM21PN1R0MC0D; Mouser Price/Stock: https://www.mouser.com/Search/Refine.aspx?Keyword=81-LQM21PN1R0MC0D; RS Part Number: 7926388; RS Price/Stock: https://uk.rs-online.com/web/p/products/7926388
PS1 = TPS2115ADRBR: Power Supply; Manufacturer_Name: Texas Instruments; Datasheet Link: http://www.ti.com/lit/gpn/tps2115a; Height: 1mm; Manufacturer_Part_Number: TPS2115ADRBR; Mouser Part Number: 595-TPS2115ADRBR; Mouser Price/Stock: https://www.mouser.com/Search/Refine.aspx?Keyword=595-TPS2115ADRBR
R19 = ERJ-2GEJ105X: RES SMD 1M OHM 5% 1/10W 0402; Manufacturer: Panasonic Electronic Components; Factory Stock: 0; Unit Price (USD): 0.00350; @ qty: 1500; Minimum Quantity: 1; Power (Watts): 0.1W, 1/10W; Temperature Coefficient: ±200ppm/°C; Part Number: ERJ-2GEJ105X; Datasheets: http://industrial.panasonic.com/www-cgi/jvcr13pz.cgi?E+PZ+3+AOA0001+ERJ2GEJ105X+7+WW; Image: //media.digikey.com/Photos/Panasonic%20Photos/ERJ-PA2-Series.jpg; Digi-Key Part Number: P1.0MJCT-ND; Quantity Available: 1082572; Packaging: Cut Tape (CT); Series: ERJ; Part Status: Active; Value: 1M; Tolerance: ±5%; Composition: Thick Film; Features: Automotive AEC-Q200; Operating Temperature: -55°C ~ 155°C; Package / Case: 0402 (1005 Metric); Supplier Device Package: 0402; Size / Dimension: 0.039" L x 0.020" W (1.00mm x 0.50mm); Height - Seated (Max): 0.016" (0.40mm); Number of Terminations: 2; Failure Rate: -
R20 = ERJ-2RKF7500X: Resistor; Manufacturer_Name: Panasonic; Allied_Number: 70265602; Datasheet Link: https://industrial.panasonic.com/cdbs/www-data/pdf/RDA0000/AOA0000C86.pdf; Height: 0.4mm; Manufacturer_Part_Number: ERJ-2RKF7500X; Mouser Part Number: 667-ERJ-2RKF7500X; Allied Price/Stock: https://www.alliedelec.com/panasonic-erj-2rkf7500x/70265602/
R21 = ERJ-2RKF8062X: RES SMD 80.6K OHM 1% 1/10W 0402; Manufacturer: Panasonic Electronic Components; Factory Stock: 0; Unit Price (USD): 0.00496; @ qty: 1500; Minimum Quantity: 1; Power (Watts): 0.1W, 1/10W; Temperature Coefficient: ±100ppm/°C; Part Number: ERJ-2RKF8062X; Datasheets: http://industrial.panasonic.com/www-cgi/jvcr13pz.cgi?E+PZ+3+AOA0002+ERJ2RKF8062X+7+WW; Image: //media.digikey.com/Photos/Panasonic%20Photos/ERJ-PA2-Series.jpg; Digi-Key Part Number: P80.6KLCT-ND; Quantity Available: 91747; Packaging: Cut Tape (CT); Series: ERJ; Part Status: Active; Value: 80.6k; Tolerance: ±1%; Composition: Thick Film; Features: Automotive AEC-Q200; Operating Temperature: -55°C ~ 155°C; Package / Case: 0402 (1005 Metric); Supplier Device Package: 0402; Size / Dimension: 0.039" L x 0.020" W (1.00mm x 0.50mm); Height - Seated (Max): 0.016" (0.40mm); Number of Terminations: 2; Failure Rate: -
R22 = ERJ-2GEJ562X: RES SMD 5.6K OHM 5% 1/10W 0402; Manufacturer: Panasonic Electronic Components; Factory Stock: 0; Unit Price (USD): 0.00350; @ qty: 1500; Minimum Quantity: 1; Power (Watts): 0.1W, 1/10W; Temperature Coefficient: ±200ppm/°C; Part Number: ERJ-2GEJ562X; Datasheets: http://industrial.panasonic.com/www-cgi/jvcr13pz.cgi?E+PZ+3+AOA0001+ERJ2GEJ562X+7+WW; Image: //media.digikey.com/Photos/Panasonic%20Photos/ERJ-PA2-Series.jpg; Digi-Key Part Number: P5.6KJCT-ND; Quantity Available: 212112; Packaging: Cut Tape (CT); Series: ERJ; Part Status: Active; Value: 5.6k; Tolerance: ±5%; Composition: Thick Film; Features: Automotive AEC-Q200; Operating Temperature: -55°C ~ 155°C; Package / Case: 0402 (1005 Metric); Supplier Device Package: 0402; Size / Dimension: 0.039" L x 0.020" W (1.00mm x 0.50mm); Height - Seated (Max): 0.016" (0.40mm); Number of Terminations: 2; Failure Rate: -
S1 = PCM12SMTR: Switch; Manufacturer_Name: C & K COMPONENTS; Allied_Number: 70417448; Datasheet Link: http://www.farnell.com/datasheets/1789487.pdf; Manufacturer_Part_Number: PCM12SMTR; Mouser Part Number: 611-PCM12SMTR; Mouser Price/Stock: https://www.mouser.com/Search/Refine.aspx?Keyword=611-PCM12SMTR; RS Part Number: 7931721P; RS Price/Stock: http://uk.rs-online.com/web/p/products/7931721P; Allied Price/Stock: https://www.alliedelec.com/c-k-pcm12smtr/70417448/
Y4 = ADS1015IRUGT: Crystal or Oscillator; Manufacturer_Name: Texas Instruments; Datasheet Link: http://www.ti.com/lit/ds/symlink/ads1015.pdf; Height: 0mm; Manufacturer_Part_Number: ADS1015IRUGT; Mouser Part Number: 595-ADS1015IRUGT; Mouser Price/Stock: https://www.mouser.com/Search/Refine.aspx?Keyword=595-ADS1015IRUGT; RS Part Number: 7321496; RS Price/Stock: https://uk.rs-online.com/web/p/products/7321496

## Sheet Sch_pwr_brd_pwr.SchDoc
size A
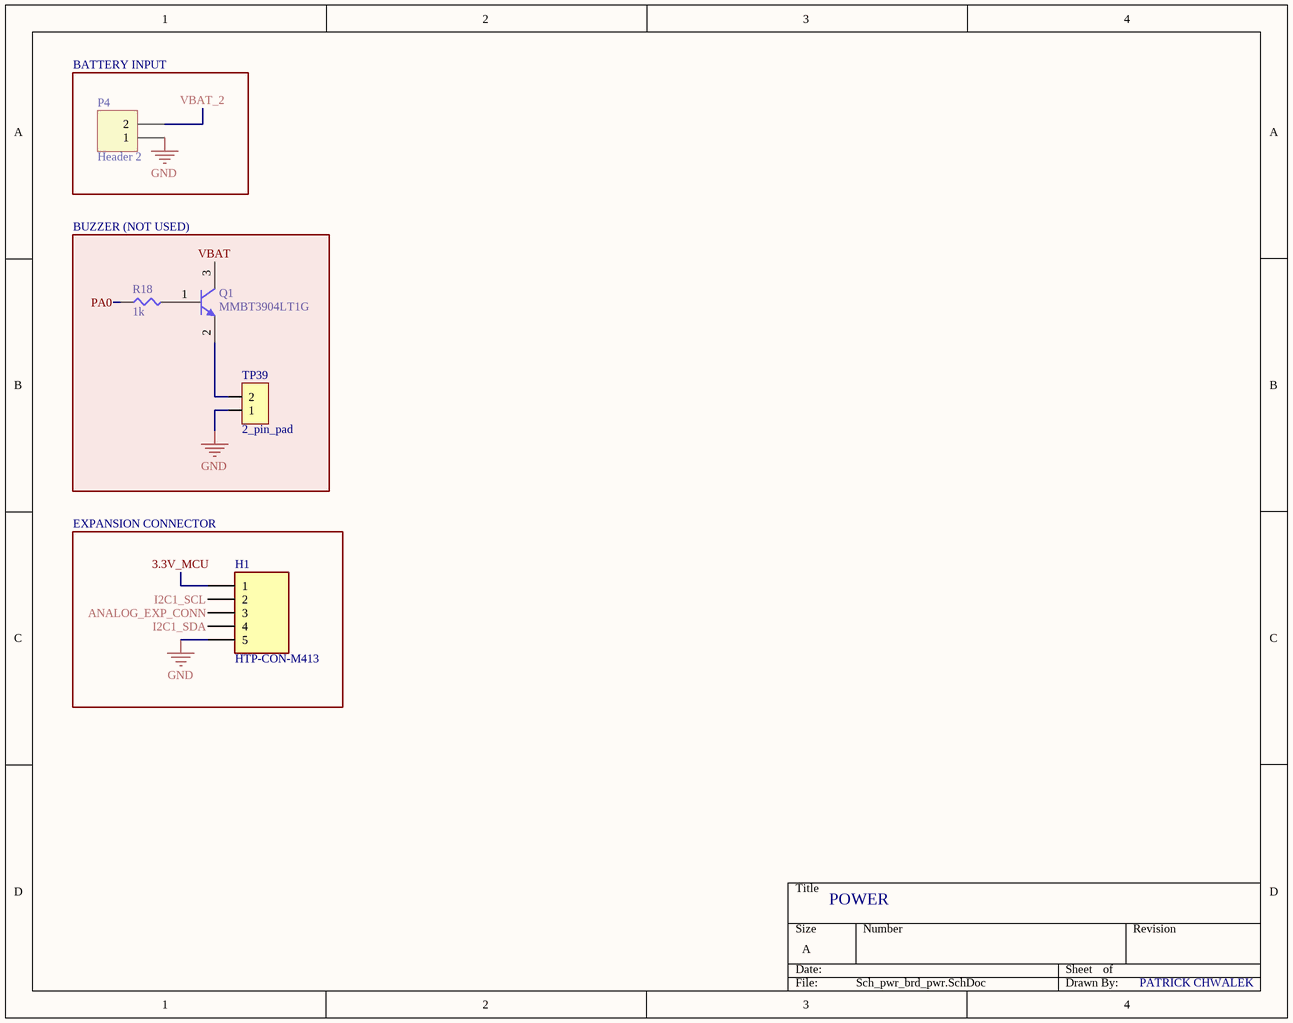
[diagram p4: Sch_pwr_brd_pwr.SchDoc]

### Parts
H1  HTP-CON-M413  [HTP-CON-M413]
P4  Header 2  [HDR1X2]
Q1  MMBT3904LT1G  [ONSC-SOT-23-3-318-08_V]
R18  1k  [SMD-0402-RES]
TP39  2_pin_pad  [Edge Connector (2-mini)]

### Blocks framed on the sheet
BATTERY INPUT: P4
BUZZER (NOT USED): Q1 R18 TP39
EXPANSION CONNECTOR: H1

### Nets
3.3V_MCU: H1.1
GND: H1.5 P4.1 TP39.1
ANALOG_EXP_CONN: H1.3
I2C1_SCL: H1.2
I2C1_SDA: H1.4
PA0: R18.1
VBAT: Q1.3(C)
VBAT_2: P4.2
NetQ1_1: Q1.1(B) R18.2
NetQ1_2: Q1.2(E) TP39.2

### Notes on the sheet
- POWER
- PATRICK CHWALEK

### Library data of the parts
P4 = Header 2: Header, 2-Pin; LatestRevisionDate: 17-Jul-2002; LatestRevisionNote: Re-released for DXP Platform.; Publisher: Altium Limited
Q1 = CMP-1048-00631-1: General Purpose Transistor, NPN Silicon, 3-Pin SOT-23, Pb-Free, Tape and Reel; Manufacturer: On Semiconductor; IC Continuous (A): 0.2; fT Min (MHz): 300; ComponentLink2Description: Datasheet; Polarity: NPN; PackageDescription: 3-Pin Small Outline Transistor, Body 2.92 x 1.3 mm, Pitch 0.95 mm; ComponentLink2URL: http://www.onsemi.cn/pub_link/Collateral/MMBT3904LT1-D.PDF; DatasheetVersion: Rev. 12; Mounting Technology: Surface Mount; PartNumber: MMBT3904LT1G; ComponentLink1URL: http://www.onsemi.com/; ComponentLink3Description: Package Specification; ComponentLink1Description: Manufacturer URL; PackageVersion: Rev. AP, 11/2009; PackageReference: SOT-23-3-318-08; Packing: Tape and Reel; ComponentLink3URL: http://www.onsemi.cn/pub_link/Collateral/318-08.PDF; RoHS: TRUE
R18 = ERJ-2GEJ102X: as R23 on sheet sch_pwr_brd_sensors; Part Number: ERJ-2GEJ102X; Datasheets: http://industrial.panasonic.com/www-cgi/jvcr13pz.cgi?E+PZ+3+AOA0001+ERJ2GEJ102X+7+WW; Image: //media.digikey.com/Photos/Panasonic%20Photos/ERJ-PA2-Series.jpg; Digi-Key Part Number: P1.0KJCT-ND; Quantity Available: 1939857; Packaging: Cut Tape (CT); Series: ERJ; Part Status: Active; Value: 1k; Tolerance: ±5%; Composition: Thick Film; Features: Automotive AEC-Q200; Operating Temperature: -55°C ~ 155°C; Package / Case: 0402 (1005 Metric); Supplier Device Package: 0402; Size / Dimension: 0.039" L x 0.020" W (1.00mm x 0.50mm); Height - Seated (Max): 0.016" (0.40mm); Number of Terminations: 2; Failure Rate: -

## Sheet Sch_pwr_brd_MCU.SchDoc
size A
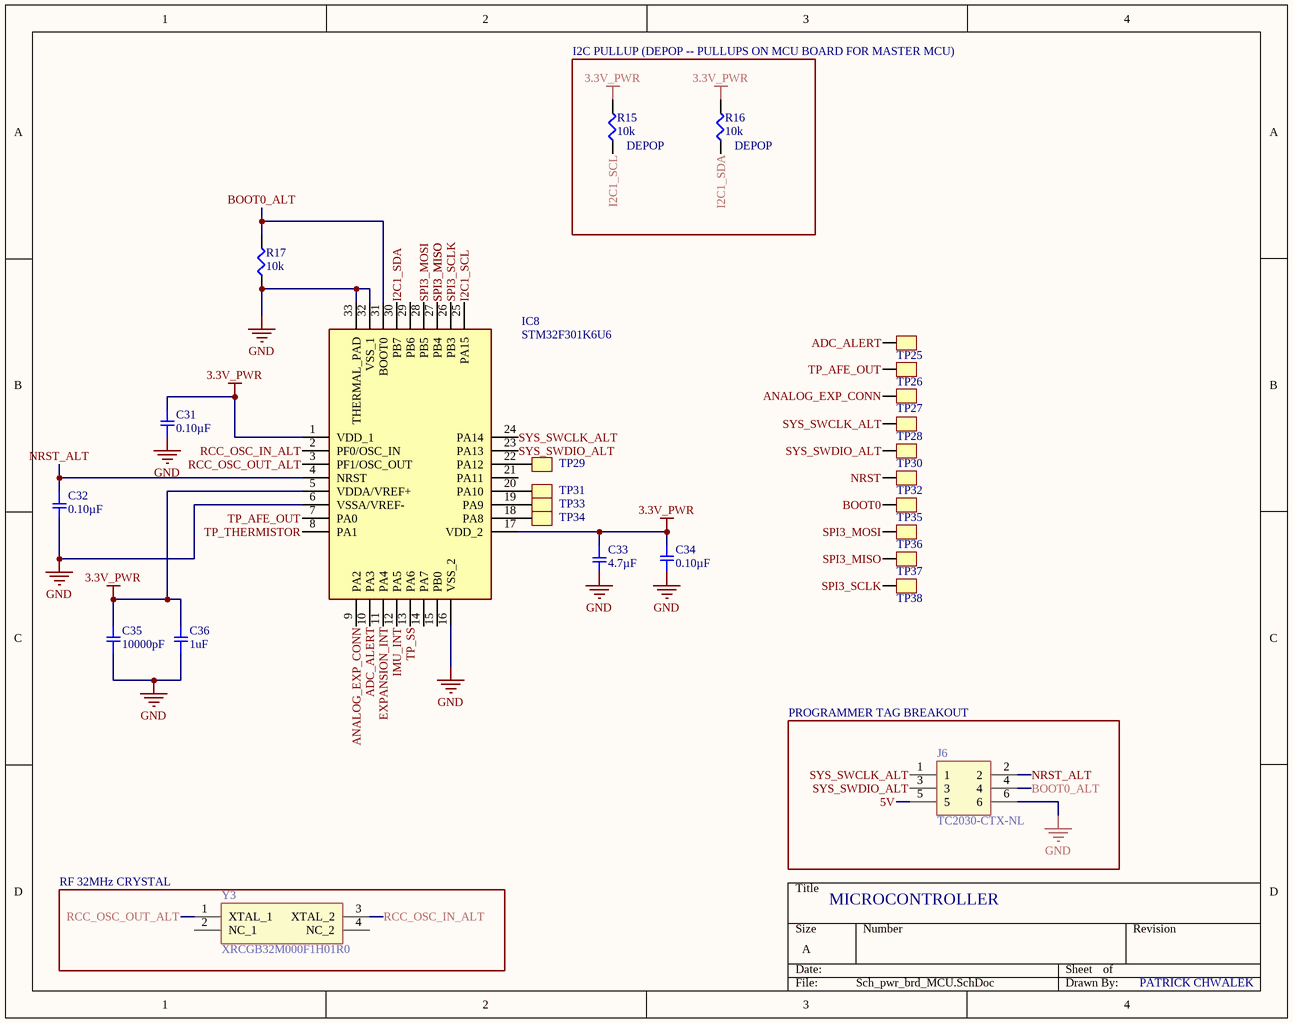
[diagram p5: Sch_pwr_brd_MCU.SchDoc]

### Parts
C31  0.10µF  [SMD-0402C]
C32  0.10µF  [SMD-0402C]
C33  4.7µF  [SMD-0402C]
C34  0.10µF  [SMD-0402C]
C35  10000pF  [SMD-0402C]
C36  1uF  [SMD-0402C]
IC8  STM32F301K6U6  [QFN50P500X500X60-33N-D]
J6  TC2030-CTX-NL  [TC2030MCPNL10]
R15  10k  [SMD-0402-RES]
R16  10k  [SMD-0402-RES]
R17  10k  [SMD-0402-RES]
TP25  TestPoint  [TestPoint_0.4mm]  (value not drawn)
TP26  TestPoint  [TestPoint_0.4mm]  (value not drawn)
TP27  TestPoint  [TestPoint_0.4mm]  (value not drawn)
TP28  TestPoint  [TestPoint_0.4mm]  (value not drawn)
TP29  TestPoint  [TESTPOINT_1MM_OVAL]  (value not drawn)
TP30  TestPoint  [TestPoint_0.4mm]  (value not drawn)
TP31  TestPoint  [TESTPOINT_1MM_OVAL]  (value not drawn)
TP32  TestPoint  [TestPoint_0.4mm]  (value not drawn)
TP33  TestPoint  [TESTPOINT_1MM_OVAL]  (value not drawn)
TP34  TestPoint  [TESTPOINT_1MM_OVAL]  (value not drawn)
TP35  TestPoint  [TestPoint_0.4mm]  (value not drawn)
TP36  TestPoint  [TestPoint_0.4mm]  (value not drawn)
TP37  TestPoint  [TestPoint_0.4mm]  (value not drawn)
TP38  TestPoint  [TestPoint_0.4mm]  (value not drawn)
Y3  XRCGB32M000F1H01R0  [XRCGB32M000F1H01R0]

### Blocks framed on the sheet
PROGRAMMER TAG BREAKOUT: J6
RF 32MHz CRYSTAL: Y3

### Nets
3.3V_PWR: C31.2 C33.1 C34.2 C35.2 C36.2 IC8.1(VDD_1) IC8.5(VDDA/VREF+) IC8.17(VDD_2) R15.2 R16.2
GND: C31.1 C32.2 C33.2 C34.1 C35.1 C36.1 IC8.6(VSSA/VREF-) IC8.16(VSS_2) IC8.32(VSS_1) IC8.33(THERMAL_PAD) J6.6 R17.1
5V: J6.5
ADC_ALERT: IC8.10(PA3) TP25.1
ANALOG_EXP_CONN: IC8.9(PA2) TP27.1
BOOT0: TP35.1
BOOT0_ALT: IC8.31(BOOT0) J6.4 R17.2
EXPANSION_INT: IC8.11(PA4)
I2C1_SCL: IC8.25(PA15) R15.1
I2C1_SDA: IC8.30(PB7) R16.1
IMU_INT: IC8.12(PA5)
NRST: TP32.1
NRST_ALT: C32.1 IC8.4(NRST) J6.2
RCC_OSC_IN_ALT: IC8.2(PF0/OSC_IN) Y3.3(XTAL_2)
RCC_OSC_OUT_ALT: IC8.3(PF1/OSC_OUT) Y3.1(XTAL_1)
SPI3_MISO: IC8.27(PB4) TP37.1
SPI3_MOSI: IC8.28(PB5) TP36.1
SPI3_SCLK: IC8.26(PB3) TP38.1
SYS_SWCLK_ALT: IC8.24(PA14) J6.1 TP28.1
SYS_SWDIO_ALT: IC8.23(PA13) J6.3 TP30.1
TP_AFE_OUT: IC8.7(PA0) TP26.1
TP_SS: IC8.13(PA6)
TP_THERMISTOR: IC8.8(PA1)
NetIC8_18: IC8.18(PA8) TP34.1
NetIC8_19: IC8.19(PA9) TP33.1
NetIC8_20: IC8.20(PA10) TP31.1
NetIC8_22: IC8.22(PA12) TP29.1

Not connected (* = marked no-connect by the designer): IC8 14(PA7) 15(PB0) 21(PA11) 29(PB6); Y3 2(NC_1) 4(NC_2)

### Notes on the sheet
- I2C PULLUP (DEPOP -- PULLUPS ON MCU BOARD FOR MASTER MCU)
- (near R15) DEPOP
- (near R16) DEPOP
- MICROCONTROLLER
- PATRICK CHWALEK

### Library data of the parts
C31 C32 C34 = GCM155R71C104KA55D: as C52 on sheet sch_pwr_brd_sensors; Datasheets: http://www.murata.com/~/media/webrenewal/support/library/catalog/products/capacitor/mlcc/c03e.ashx; Image: //media.digikey.com/Renders/Murata%20Renders/ZRB-SERIES-0402.jpg; Digi-Key Part Number: 490-4759-1-ND; Part Number: GCM155R71C104KA55D; Quantity Available: 734194; @ qty: 0; Packaging: Cut Tape (CT); Series: GCM; Part Status: Active; Value: 0.10µF; Voltage: 16V; Temperature Coefficient: X7R; Operating Temperature: -55°C ~ 125°C; Features: -; Ratings: AEC-Q200; Applications: Automotive; Mounting Type: Surface Mount, MLCC; Package / Case: 0402 (1005 Metric); Size / Dimension: 0.039" L x 0.020" W (1.00mm x 0.50mm); Height - Seated (Max): -; Thickness (Max): 0.022" (0.55mm); Lead Spacing: -; Lead Style: -
C33 = GRM153R60G475ME15D: as C42 on sheet Sch_pwr_brd_pwr_sys; Datasheets: http://psearch.en.murata.com/capacitor/product/GRM153R60G475ME15%23.pdf; Image: //media.digikey.com/Renders/Murata%20Renders/ZRB-SERIES-0402.jpg; Digi-Key Part Number: 490-13231-1-ND; Part Number: GRM153R60G475ME15D; Quantity Available: 9100; @ qty: 0; Packaging: Cut Tape (CT); Series: GRM; Part Status: Active; Value: 4.7µF; Voltage: 4V; Temperature Coefficient: X5R; Operating Temperature: -55°C ~ 85°C; Features: -; Ratings: -; Applications: General Purpose; Mounting Type: Surface Mount, MLCC; Package / Case: 0402 (1005 Metric); Size / Dimension: 0.039" L x 0.020" W (1.00mm x 0.50mm); Height - Seated (Max): -; Thickness (Max): 0.013" (0.33mm); Lead Spacing: -; Lead Style: -
C35 = GCM155R71H103KA55D: as C44 on sheet sch_pwr_brd_sensors; Datasheets: http://www.murata.com/~/media/webrenewal/support/library/catalog/products/capacitor/mlcc/c03e.ashx; Image: //media.digikey.com/Renders/Murata%20Renders/ZRB-SERIES-0402.jpg; Digi-Key Part Number: 490-4762-1-ND; Part Number: GCM155R71H103KA55D; Quantity Available: 650067; @ qty: 0; Packaging: Cut Tape (CT); Series: GCM; Part Status: Active; Value: 10000pF; Voltage: 50V; Temperature Coefficient: X7R; Operating Temperature: -55°C ~ 125°C; Features: -; Ratings: AEC-Q200; Applications: Automotive; Mounting Type: Surface Mount, MLCC; Package / Case: 0402 (1005 Metric); Size / Dimension: 0.039" L x 0.020" W (1.00mm x 0.50mm); Height - Seated (Max): -; Thickness (Max): 0.022" (0.55mm); Lead Spacing: -; Lead Style: -
C36 = GCM155R71H103KA55D: CAP CER 1UF 0402; Part Number: JMK105BJ105KP-F; Manufacturer: Murata Electronics North America; Factory Stock: 0; Unit Price (USD): 0.1; Minimum Quantity: 1; Tolerance: ±10%; Voltage: 50V; Temperature Coefficient: X7R; Datasheets: http://www.murata.com/~/media/webrenewal/support/library/catalog/products/capacitor/mlcc/c03e.ashx; Image: //media.digikey.com/Renders/Murata%20Renders/ZRB-SERIES-0402.jpg; Digi-Key Part Number: 490-4762-1-ND; Quantity Available: 650067; @ qty: 0; Packaging: Cut Tape (CT); Series: GCM; Part Status: Active; Value: 1uF; Operating Temperature: -55°C ~ 125°C; Features: -; Ratings: AEC-Q200; Applications: Automotive; Mounting Type: Surface Mount, MLCC; Package / Case: 0402 (1005 Metric); Size / Dimension: 0.039" L x 0.020" W (1.00mm x 0.50mm); Height - Seated (Max): -; Thickness (Max): 0.022" (0.55mm); Lead Spacing: -; Lead Style: -
IC8 = STM32F301K6U6: Integrated Circuit; Manufacturer_Name: STMicroelectronics; Datasheet Link: http://www.mouser.com/ds/2/389/stm32f301c6-956213.pdf; Height: 0.6mm; Manufacturer_Part_Number: STM32F301K6U6; Mouser Part Number: 511-STM32F301K6U6; Mouser Price/Stock: https://www.mouser.com/Search/Refine.aspx?Keyword=511-STM32F301K6U6
J6 = TC2030-CTX-NL: Connector; Manufacturer_Name: Tag Connect; Datasheet Link: http://www.tag-connect.com/Materials/TC2030-CTX.pdf; Height: 18mm; Manufacturer_Part_Number: TC2030-CTX-NL
R15-R17 = ERJ-2GEJ103X: as R26 on sheet sch_pwr_brd_sensors; Part Number: ERJ-2GEJ103X; Datasheets: http://industrial.panasonic.com/www-cgi/jvcr13pz.cgi?E+PZ+3+AOA0001+ERJ2GEJ103X+7+WW; Image: //media.digikey.com/Photos/Panasonic%20Photos/ERJ-PA2-Series.jpg; Digi-Key Part Number: P10KJCT-ND; Quantity Available: 2560215; Packaging: Cut Tape (CT); Series: ERJ; Part Status: Active; Value: 10k; Tolerance: ±5%; Composition: Thick Film; Features: Automotive AEC-Q200; Operating Temperature: -55°C ~ 155°C; Package / Case: 0402 (1005 Metric); Supplier Device Package: 0402; Size / Dimension: 0.039" L x 0.020" W (1.00mm x 0.50mm); Height - Seated (Max): 0.016" (0.40mm); Number of Terminations: 2; Failure Rate: -
Y3 = XRCGB32M000F1H01R0: Crystal or Oscillator; Manufacturer_Name: Murata Electronics; Datasheet Link: https://www.murata.com/en-eu/products/productdetail?partno=XRCGB32M000F1H01R0; Height: 0.7mm; Manufacturer_Part_Number: XRCGB32M000F1H01R0; Mouser Part Number: 81-XRCGB32M000F1H01R; Mouser Price/Stock: https://www.mouser.com/Search/Refine.aspx?Keyword=81-XRCGB32M000F1H01R

## Sheet Sch_mcu_brd_sensors.SchDoc
size A
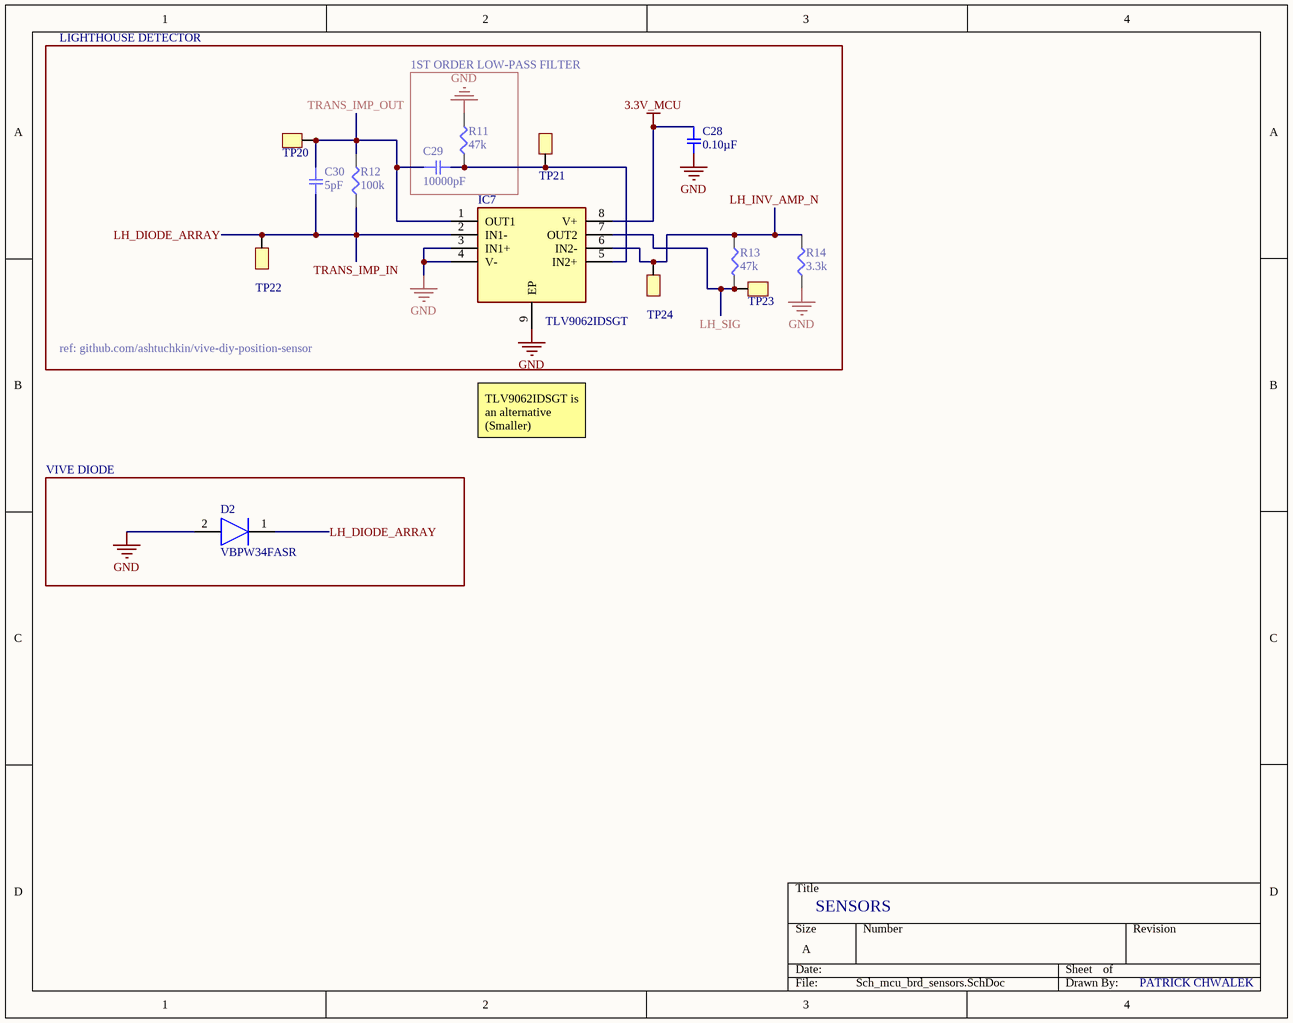
[diagram p6: Sch_mcu_brd_sensors.SchDoc]

### Parts
C28  0.10µF  [SMD-0402C]
C29  10000pF  [SMD-0402C]
C30  5pF  [SMD-0402C]
D2  VBPW34FASR  [VBPW34FASR]
IC7  TLV9062IDSGT  [SON50P200X200X80-9N]
R11  47k  [SMD-0402-RES]
R12  100k  [SMD-0402-RES]
R13  47k  [SMD-0402-RES]
R14  3.3k  [SMD-0402-RES]
TP20  TestPoint  [TestPoint_0.4mm]  (value not drawn)
TP21  TestPoint  [TestPoint_0.4mm]  (value not drawn)
TP22  TestPoint  [TestPoint_0.4mm]  (value not drawn)
TP23  TestPoint  [TestPoint_0.4mm]  (value not drawn)
TP24  TestPoint  [TestPoint_0.4mm]  (value not drawn)

### Blocks framed on the sheet
1ST ORDER LOW-PASS FILTER: C29 R11
VIVE DIODE: D2

### Nets
3.3V_MCU: C28.1 IC7.8(V+)
GND: C28.2 D2.2(K) IC7.3(IN1+) IC7.4(V-) IC7.9(EP) R11.2 R14.1
LH_DIODE_ARRAY: C30.2 D2.1(A) IC7.2(IN1-) R12.1 TP22.1  [also labelled TRANS_IMP_IN]
LH_INV_AMP_N: IC7.6(IN2-) R13.1 R14.2 TP24.1
LH_SIG: IC7.7(OUT2) R13.2 TP23.1
TRANS_IMP_OUT: C29.1 C30.1 IC7.1(OUT1) R12.2 TP20.1
NetC29_2: C29.2 IC7.5(IN2+) R11.1 TP21.1

### Notes on the sheet
- LIGHTHOUSE DETECTOR
- ref: github.com/ashtuchkin/vive-diy-position-sensor
- TLV9062IDSGT is an alternative (Smaller)
- SENSORS
- PATRICK CHWALEK

### Library data of the parts
C28 = GCM155R71C104KA55D: as C52 on sheet sch_pwr_brd_sensors; Datasheets: http://www.murata.com/~/media/webrenewal/support/library/catalog/products/capacitor/mlcc/c03e.ashx; Image: //media.digikey.com/Renders/Murata%20Renders/ZRB-SERIES-0402.jpg; Digi-Key Part Number: 490-4759-1-ND; Part Number: GCM155R71C104KA55D; Quantity Available: 734194; @ qty: 0; Packaging: Cut Tape (CT); Series: GCM; Part Status: Active; Value: 0.10µF; Voltage: 16V; Temperature Coefficient: X7R; Operating Temperature: -55°C ~ 125°C; Features: -; Ratings: AEC-Q200; Applications: Automotive; Mounting Type: Surface Mount, MLCC; Package / Case: 0402 (1005 Metric); Size / Dimension: 0.039" L x 0.020" W (1.00mm x 0.50mm); Height - Seated (Max): -; Thickness (Max): 0.022" (0.55mm); Lead Spacing: -; Lead Style: -
C29 = GCM155R71H103KA55D: as C44 on sheet sch_pwr_brd_sensors; Datasheets: http://www.murata.com/~/media/webrenewal/support/library/catalog/products/capacitor/mlcc/c03e.ashx; Image: //media.digikey.com/Renders/Murata%20Renders/ZRB-SERIES-0402.jpg; Digi-Key Part Number: 490-4762-1-ND; Part Number: GCM155R71H103KA55D; Quantity Available: 650067; @ qty: 0; Packaging: Cut Tape (CT); Series: GCM; Part Status: Active; Value: 10000pF; Voltage: 50V; Temperature Coefficient: X7R; Operating Temperature: -55°C ~ 125°C; Features: -; Ratings: AEC-Q200; Applications: Automotive; Mounting Type: Surface Mount, MLCC; Package / Case: 0402 (1005 Metric); Size / Dimension: 0.039" L x 0.020" W (1.00mm x 0.50mm); Height - Seated (Max): -; Thickness (Max): 0.022" (0.55mm); Lead Spacing: -; Lead Style: -
C30 = GJM1555C1H5R0BB01D: CAP CER 5PF 50V NP0 0402; Manufacturer: Murata Electronics North America; Factory Stock: 0; Unit Price (USD): 0.2; Minimum Quantity: 1; Tolerance: ±0.1pF; Temperature Coefficient: C0G, NP0; Datasheets: http://www.murata.com/~/media/webrenewal/support/library/catalog/products/capacitor/mlcc/c02e.pdf; Image: //media.digikey.com/Renders/Murata%20Renders/ZRB-SERIES-0402.jpg; Digi-Key Part Number: 490-8103-1-ND; Part Number: GJM1555C1H5R0BB01D; Quantity Available: 17055; @ qty: 0; Packaging: Cut Tape (CT); Series: GJM; Part Status: Active; Value: 5pF; Voltage: 50V; Operating Temperature: -55°C ~ 125°C; Features: High Q, Low Loss; Ratings: -; Applications: RF, Microwave, High Frequency; Mounting Type: Surface Mount, MLCC; Package / Case: 0402 (1005 Metric); Size / Dimension: 0.039" L x 0.020" W (1.00mm x 0.50mm); Height - Seated (Max): -; Thickness (Max): 0.022" (0.55mm); Lead Spacing: -; Lead Style: -
D2 = VBPW34FASR: Diode; Manufacturer_Name: Vishay; Datasheet Link: https://www.vishay.com/docs/81127/vbpw34fa.pdf; Height: 1.3mm; Manufacturer_Part_Number: VBPW34FASR; Mouser Part Number: 782-VBPW34FASR; Mouser Price/Stock: https://www.mouser.com/Search/Refine.aspx?Keyword=782-VBPW34FASR; RS Part Number: 7689401; RS Price/Stock: https://uk.rs-online.com/web/p/products/7689401
IC7 = TLV9062IDSGT: Integrated Circuit; Manufacturer_Name: Texas Instruments; Datasheet Link: http://www.ti.com/lit/gpn/TLV9062; Height: 0.8mm; Manufacturer_Part_Number: TLV9062IDSGT; Mouser Part Number: 595-TLV9062IDSGT; Mouser Price/Stock: https://www.mouser.com/Search/Refine.aspx?Keyword=595-TLV9062IDSGT
R11 R13 = ERJ-2GEJ473X: RES SMD 47K OHM 5% 1/10W 0402; Manufacturer: Panasonic Electronic Components; Factory Stock: 0; Unit Price (USD): 0.00350; @ qty: 1500; Minimum Quantity: 1; Power (Watts): 0.1W, 1/10W; Temperature Coefficient: ±200ppm/°C; Part Number: ERJ-2GEJ473X; Datasheets: http://industrial.panasonic.com/www-cgi/jvcr13pz.cgi?E+PZ+3+AOA0001+ERJ2GEJ473X+7+WW; Image: //media.digikey.com/Photos/Panasonic%20Photos/ERJ-PA2-Series.jpg; Digi-Key Part Number: P47KJCT-ND; Quantity Available: 5182645; Packaging: Cut Tape (CT); Series: ERJ; Part Status: Active; Value: 47k; Tolerance: ±5%; Composition: Thick Film; Features: Automotive AEC-Q200; Operating Temperature: -55°C ~ 155°C; Package / Case: 0402 (1005 Metric); Supplier Device Package: 0402; Size / Dimension: 0.039" L x 0.020" W (1.00mm x 0.50mm); Height - Seated (Max): 0.016" (0.40mm); Number of Terminations: 2; Failure Rate: -
R12 = ERJ-2GEJ104X: as R1 on sheet Sch_front; Part Number: ERJ-2GEJ104X; Datasheets: http://industrial.panasonic.com/www-cgi/jvcr13pz.cgi?E+PZ+3+AOA0001+ERJ2GEJ104X+7+WW; Image: //media.digikey.com/Photos/Panasonic%20Photos/ERJ-PA2-Series.jpg; Digi-Key Part Number: P100KJCT-ND; Quantity Available: 2387986; Packaging: Cut Tape (CT); Series: ERJ; Part Status: Active; Value: 100k; Tolerance: ±5%; Composition: Thick Film; Features: Automotive AEC-Q200; Operating Temperature: -55°C ~ 155°C; Package / Case: 0402 (1005 Metric); Supplier Device Package: 0402; Size / Dimension: 0.039" L x 0.020" W (1.00mm x 0.50mm); Height - Seated (Max): 0.016" (0.40mm); Number of Terminations: 2; Failure Rate: -
R14 = ERJ-2GEJ332X: RES SMD 3.3K OHM 5% 1/10W 0402; Manufacturer: Panasonic Electronic Components; Factory Stock: 0; Unit Price (USD): 0.00350; @ qty: 1500; Minimum Quantity: 1; Power (Watts): 0.1W, 1/10W; Temperature Coefficient: ±200ppm/°C; Part Number: ERJ-2GEJ332X; Datasheets: http://industrial.panasonic.com/www-cgi/jvcr13pz.cgi?E+PZ+3+AOA0001+ERJ2GEJ332X+7+WW; Image: //media.digikey.com/Photos/Panasonic%20Photos/ERJ-PA2-Series.jpg; Digi-Key Part Number: P3.3KJCT-ND; Quantity Available: 514266; Packaging: Cut Tape (CT); Series: ERJ; Part Status: Active; Value: 3.3k; Tolerance: ±5%; Composition: Thick Film; Features: Automotive AEC-Q200; Operating Temperature: -55°C ~ 155°C; Package / Case: 0402 (1005 Metric); Supplier Device Package: 0402; Size / Dimension: 0.039" L x 0.020" W (1.00mm x 0.50mm); Height - Seated (Max): 0.016" (0.40mm); Number of Terminations: 2; Failure Rate: -